# EAGLE design railsegments (EAGLE 4.16)
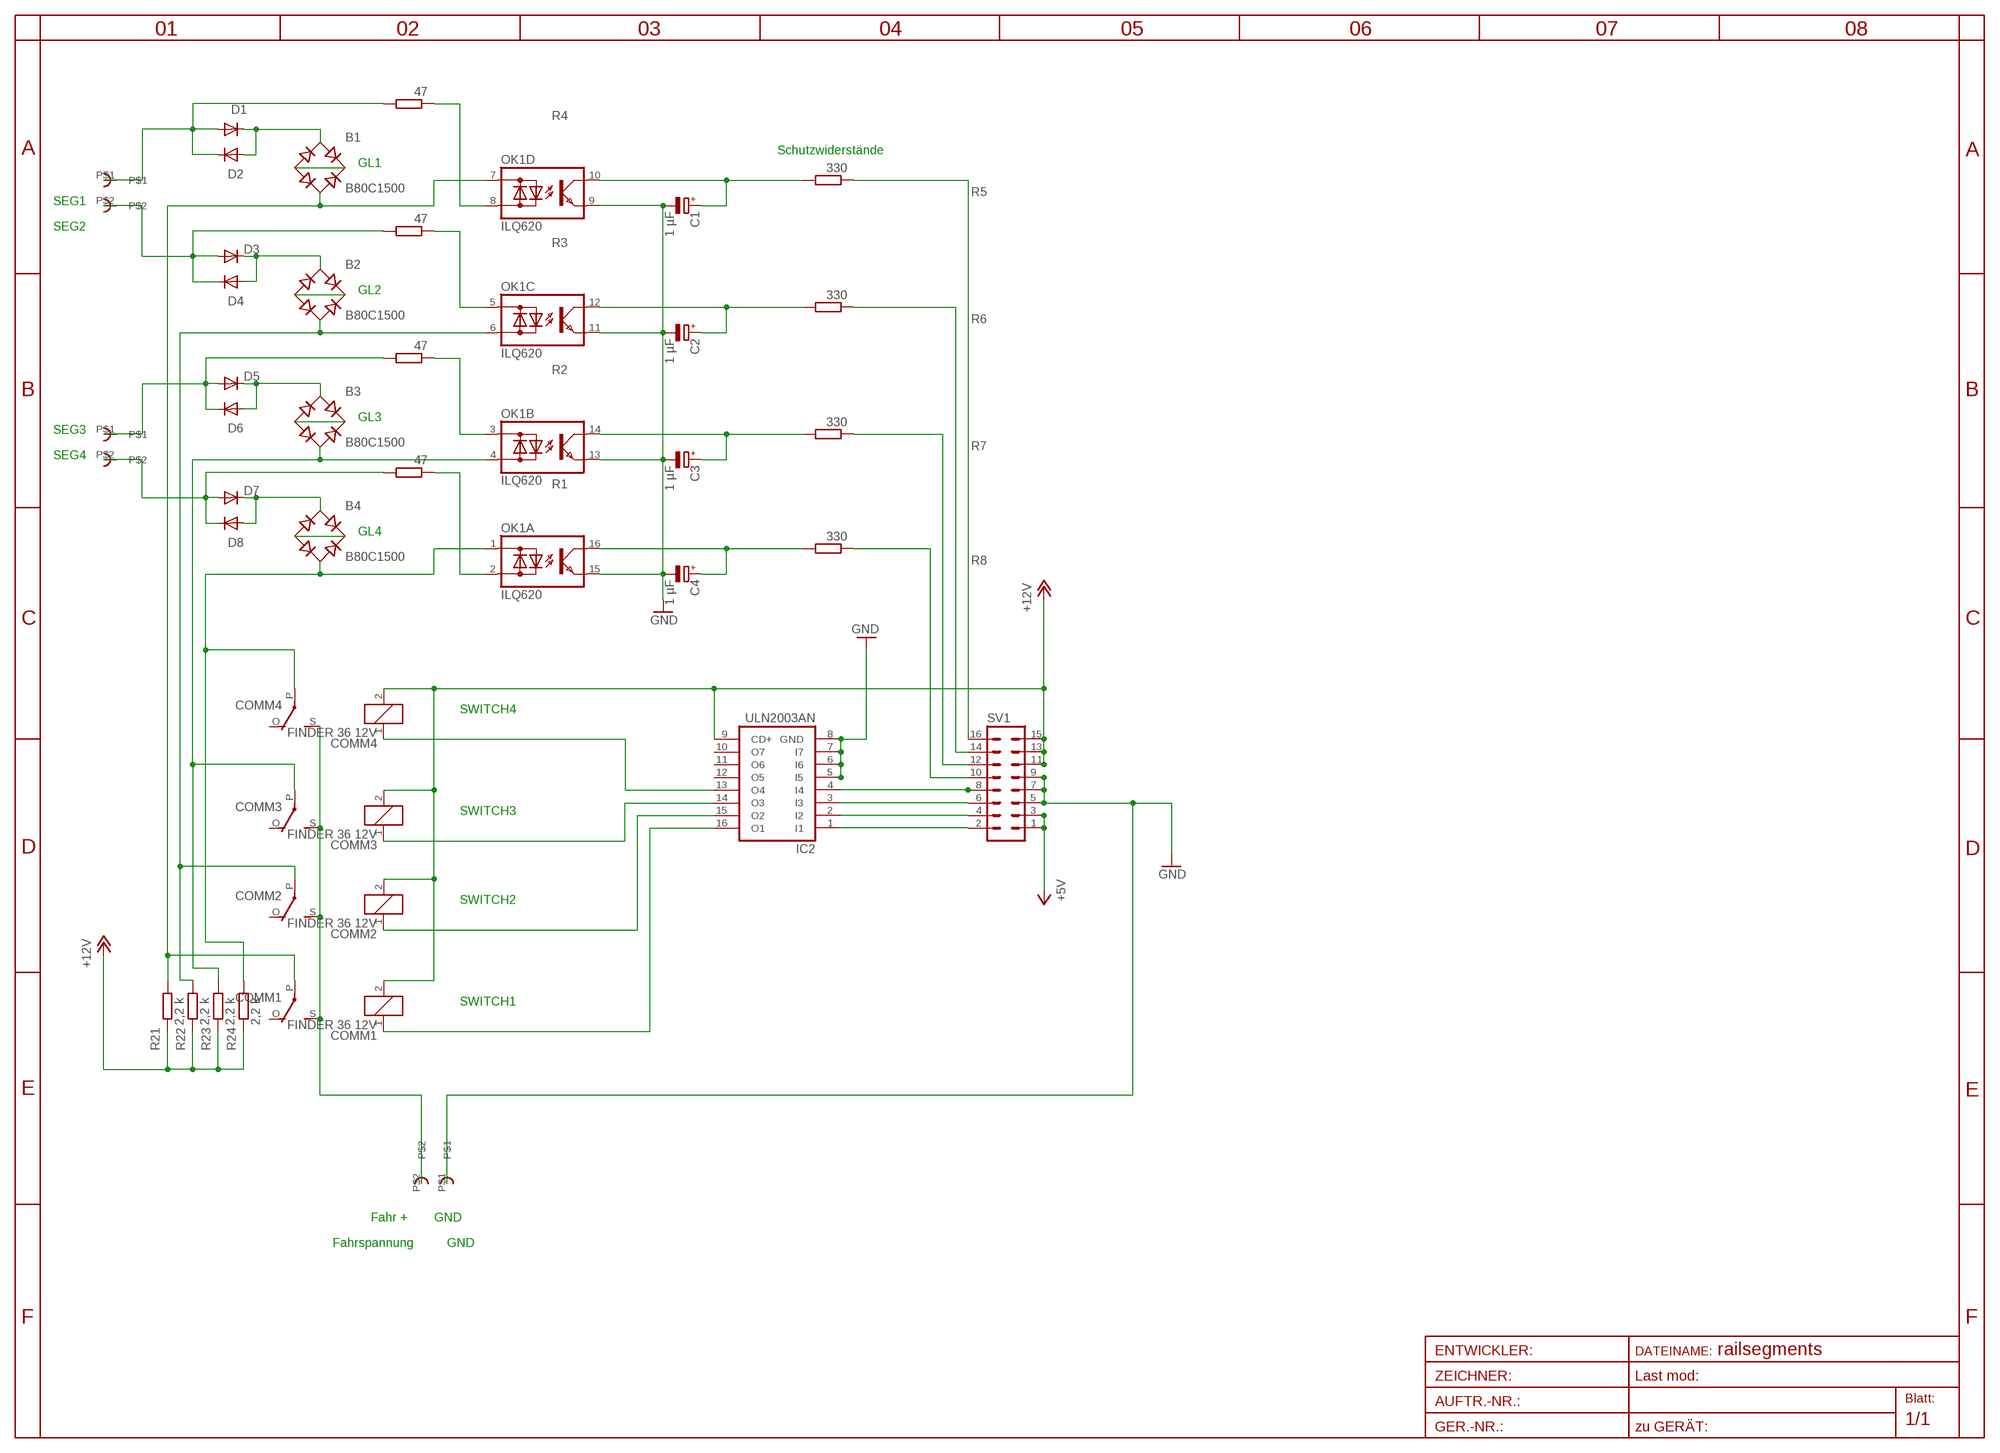
[diagram p0: schematic, sheet 1]

## Parts
B1  B80C1500  RECTIFIER-RB1A  [RB1A]
B2  B80C1500  RECTIFIER-RB1A  [RB1A]
B3  B80C1500  RECTIFIER-RB1A  [RB1A]
B4  B80C1500  RECTIFIER-RB1A  [RB1A]
C1  1 µF  CPOL-EUE2-4  [E2-4]
C2  1 µF  CPOL-EUE2-4  [E2-4]
C3  1 µF  CPOL-EUE2-4  [E2-4]
C4  1 µF  CPOL-EUE2-4  [E2-4]
COMM1  FINDER 36 12V  G5L  [G5LE]
COMM2  FINDER 36 12V  G5L  [G5LE]
COMM3  FINDER 36 12V  G5L  [G5LE]
COMM4  FINDER 36 12V  G5L  [G5LE]
D1  DIODE-D-2.5  [D-2.5]
D2  DIODE-D-2.5  [D-2.5]
D3  DIODE-D-2.5  [D-2.5]
D4  DIODE-D-2.5  [D-2.5]
D5  DIODE-D-2.5  [D-2.5]
D6  DIODE-D-2.5  [D-2.5]
D7  DIODE-D-2.5  [D-2.5]
D8  DIODE-D-2.5  [D-2.5]
GND  RIACON101-2  [RIACON101-2]
IC2  ULN2003AN  [DIL16]
OK1  ILQ620  [DIL16]
PRUEFSPANNUNG3  RIACON101-2  [RIACON101-2]
PRUEFSPANNUNG4  RIACON101-2  [RIACON101-2]
R1  47  R-EU_0204/5  [0204/5]
R2  47  R-EU_0204/5  [0204/5]
R3  47  R-EU_0204/5  [0204/5]
R4  47  R-EU_0204/5  [0204/5]
R5  330  R-EU_0204/2V  [0204V]
R6  330  R-EU_0204/2V  [0204V]
R7  330  R-EU_0204/2V  [0204V]
R8  330  R-EU_0204/2V  [0204V]
R21  2,2 k  R-EU_0204/2V  [0204V]
R22  2,2 k  R-EU_0204/2V  [0204V]
R23  2,2 k  R-EU_0204/2V  [0204V]
R24  2,2 k  R-EU_0204/2V  [0204V]
SV1  ML16  [ML16]

## Nets
+5V: SV1.1 SV1.3
+12V: COMM1.2 COMM2.2 COMM3.2 COMM4.2 IC2.9(CD+) R21.1 R22.1 R23.1 R24.1 SV1.11 SV1.13 SV1.15
GND: C1.- C2.- C3.- C4.- GND.P$1 IC2.5(I5) IC2.6(I6) IC2.7(I7) IC2.8(GND) OK1.9(D:E) OK1.11(C:E) OK1.13(B:E) OK1.15(A:E) SV1.5 SV1.7 SV1.9
IN_1: IC2.1(I1) SV1.2
IN_2: IC2.2(I2) SV1.4
IN_3: IC2.3(I3) SV1.6
IN_4: IC2.4(I4) SV1.8
N$1: OK1.2(A:AC2) R1.1
N$2: OK1.8(D:AC2) R4.1
N$3: B1.AC2 COMM1.P(2:P) OK1.7(D:AC1) R21.2
N$10: B1.+ B1.-
N$11: B2.+ B2.-
N$12: B3.+ B3.-
N$13: B4.+ B4.-
N$17: B1.AC1 D1.C D2.A
N$18: B4.AC1 D7.C D8.A
OPTO_OUT_1: C1.+ OK1.10(D:C) R5.2
OPTO_OUT_2: C2.+ OK1.12(C:C) R6.2
OPTO_OUT_3: C3.+ OK1.14(B:C) R7.2
OPTO_OUT_4: C4.+ OK1.16(A:C) R8.2
OUT_1: R5.1 SV1.16
OUT_2: R6.1 SV1.14
OUT_3: R7.1 SV1.12
OUT_4: R8.1 SV1.10
RAILPOWER_PLUS: COMM1.S(2:S) COMM2.S(2:S) COMM3.S(2:S) COMM4.S(2:S) GND.P$2
RELAY_DRIVE_1: COMM1.1 IC2.16(O1)
RELAY_DRIVE_2: COMM2.1 IC2.15(O2)
RELAY_DRIVE_3: COMM3.1 IC2.14(O3)
RELAY_DRIVE_4: COMM4.1 IC2.13(O4)
SEG1: D1.A D2.C PRUEFSPANNUNG4.P$1 R4.2
SEG2: B2.AC1 D3.C D4.A
SEG3: B3.AC1 D5.C D6.A
SEG5: D3.A D4.C PRUEFSPANNUNG4.P$2 R3.2
SEG6: D5.A D6.C PRUEFSPANNUNG3.P$1 R2.2
SEG7: D7.A D8.C PRUEFSPANNUNG3.P$2 R1.2
SEG_SW2: B2.AC2 COMM2.P(2:P) OK1.6(C:AC2) R22.2
SEG_SW2A: OK1.5(C:AC1) R3.1
SEG_SW3: B3.AC2 COMM3.P(2:P) OK1.4(B:AC2) R23.2
SEG_SW3A: OK1.3(B:AC1) R2.1
SEG_SW4: B4.AC2 COMM4.P(2:P) OK1.1(A:AC1) R24.2
Unconnected: COMM1.O(2:O) COMM2.O(2:O) COMM3.O(2:O) COMM4.O(2:O) IC2.10(O7) IC2.11(O6) IC2.12(O5)

## Notes on the sheet
- Schutzwiderstände
- GL1
- SEG1
- SEG2
- GL2
- GL3
- SEG3
- SEG4
- GL4
- SWITCH4
- SWITCH3
- SWITCH2
- SWITCH1
- Fahr + | GND
- Fahrspannung | GND

## Library data of the parts
B1-B4 = rectifier:RECTIFIER-: Rectifier
C1-C4 = rcl:CPOL-EU: POLARIZED CAPACITOR, European symbol
COMM1-COMM4 = relay:G5L: RELAY 1 x switch, 10 A/120 V AC, 8 A/30 V ADC, Omron
D1-D8 = diode:DIODE-: DIODE
GND PRUEFSPANNUNG3 PRUEFSPANNUNG4 = con-riacon101:RIACON101-2: Riaconn Schreaubklemme 101
IC2 = uln-udn:ULN2003A: DRIVER ARRAY
OK1 = optocoupler:ILQ620: SIEMENS OPTO COUPLER
R1-R8 R21-R24 = rcl:R-EU_: RESISTOR, European symbol
SV1 = con-harting-ml:ML16: HARTING

## Board
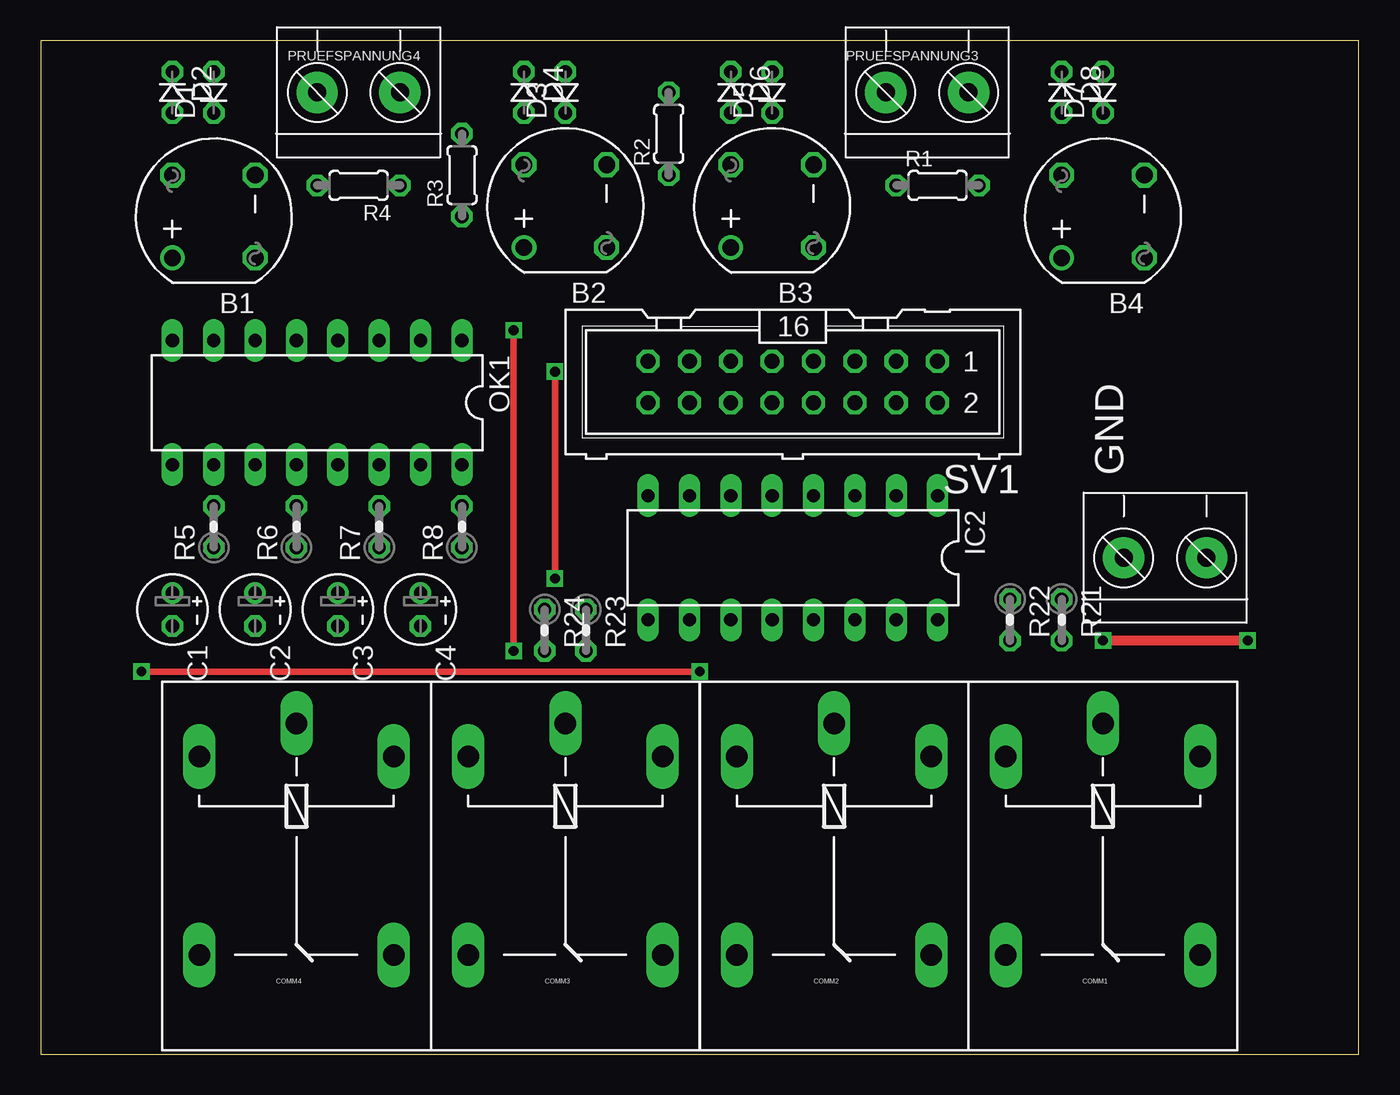
[diagram p1: board, top side]
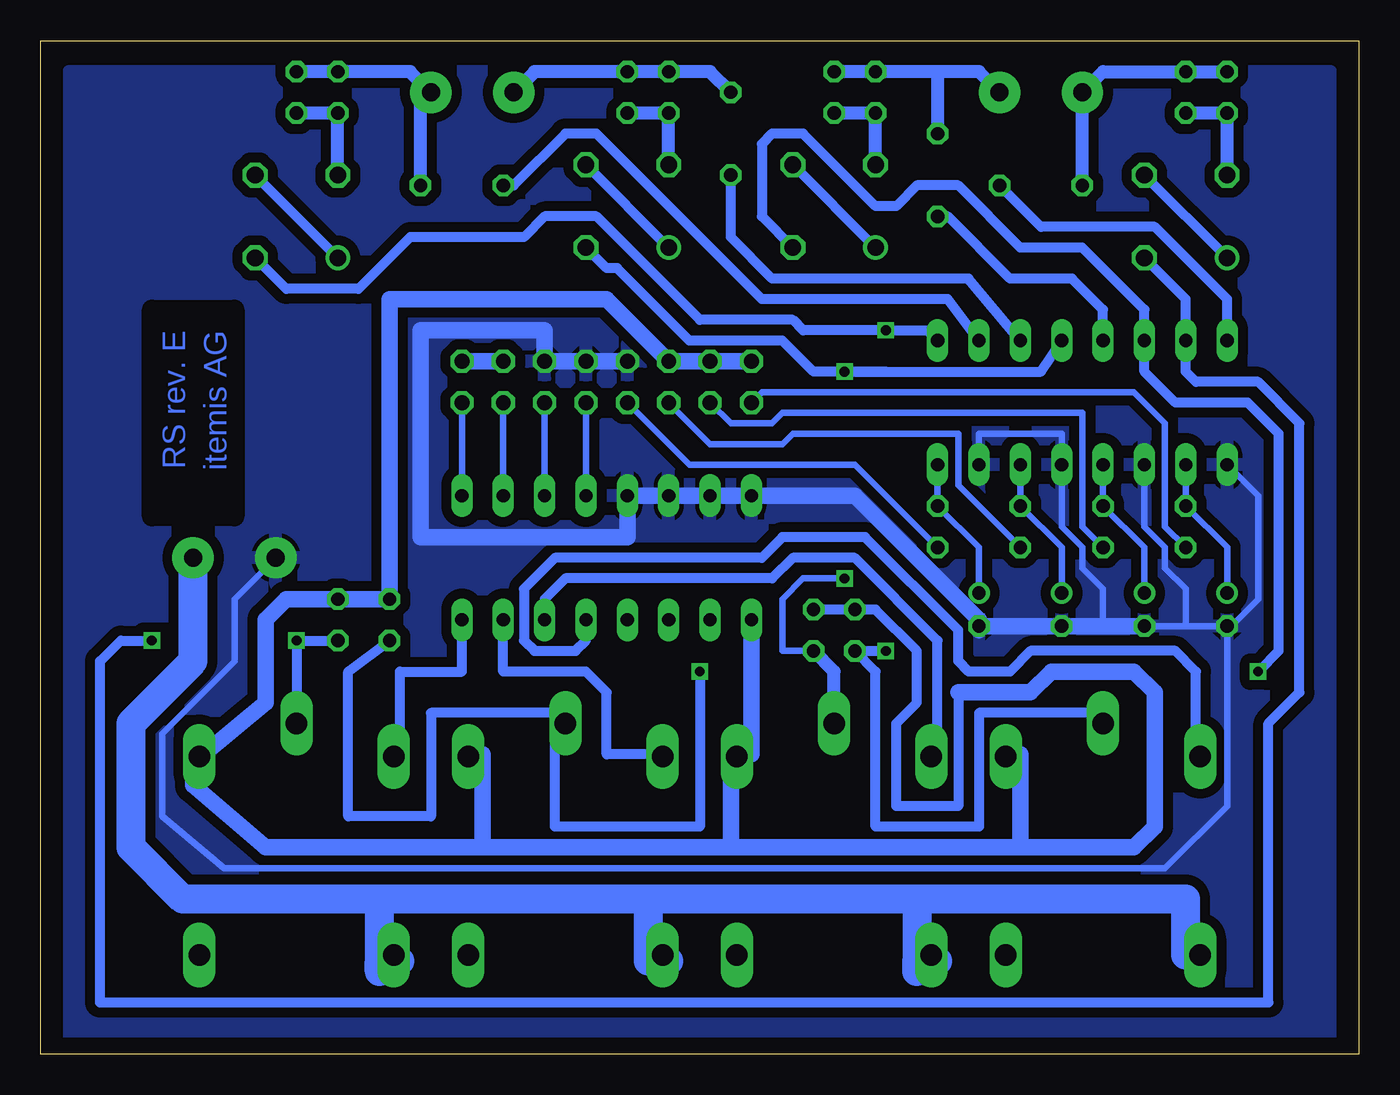
[diagram p2: board, bottom side, seen from below]

Size 80.95 x 62.22 mm. Coordinates in mm from the lower left corner, seen from the top.
Outline: 0,0 80.95,0 80.95,62.22 0,62.22 0,0
Copper layers (1*16): Top 0.035mm / dielectric 1.5mm / Bottom 0.035mm
Design rules "default": minimum track width 10mil, minimum drill 24mil, track to track 8mil, track to pad 8mil, pad to pad 8mil, via to via 8mil, smd to smd 8mil, copper to edge 40mil, drill to drill 8mil, minimum pad ring 10mil, minimum via ring 8mil, stop-mask expansion 4mil, vias tented up to drill 0mil, thermal gap 10mil
tRestrict: area 1.1,1.3 to 6.2,55.9; area 75.4,0.6 to 80.5,55.2
bRestrict: area 69.1,33 to 74.1,45.7

### Footprints (pad centres in the part's own frame; a part is rotated, then mirrored left to right if it is on the bottom)
RB1A = drill 1.016 round: + -2.54,2.54 | drill 1.016 octagon: - 2.54,-2.54; AC1 2.54,2.54; AC2 -2.54,-2.54
E2-4 = drill 0.813 pad 1.27 round: + -1.016,0 | drill 0.813 pad 1.27 octagon: - 1.016,0
G5LE = drill 1.321 long: 1 -7.493,-5.969; 2 -7.493,5.969; O 4.699,5.969; P -9.525,0; S 4.699,-5.969
D-2.5 = drill 0.813 octagon: A 1.27,0; C -1.27,0
RIACON101-2 = drill 1.1 pad 2.54 round: P$1 0,2.54; P$2 0,-2.54
DIL16 = drill 0.813 long: 1 -8.89,-3.81; 2 -6.35,-3.81; 3 -3.81,-3.81; 4 -1.27,-3.81; 5 1.27,-3.81; 6 3.81,-3.81; 7 6.35,-3.81; 8 8.89,-3.81; 9 8.89,3.81; 10 6.35,3.81; 11 3.81,3.81; 12 1.27,3.81; 13 -1.27,3.81; 14 -3.81,3.81; 15 -6.35,3.81; 16 -8.89,3.81
0204/5 = drill 0.813 octagon: 1 -2.54,0; 2 2.54,0
0204V = drill 0.813 octagon: 1 -1.27,0; 2 1.27,0
ML16 = drill 0.914 octagon: 1 -8.89,-1.27; 2 -8.89,1.27; 3 -6.35,-1.27; 4 -6.35,1.27; 5 -3.81,-1.27; 6 -3.81,1.27; 7 -1.27,-1.27; 8 -1.27,1.27; 9 1.27,-1.27; 10 1.27,1.27; 11 3.81,-1.27; 12 3.81,1.27; 13 6.35,-1.27; 14 6.35,1.27; 15 8.89,-1.27; 16 8.89,1.27

### Placement (x,y rotation side)
B1  10.63,51.43 90 top
B2  32.22,52.07 90 top
B3  44.92,52.07 90 top
B4  65.24,51.43 90 top
C1  8.09,27.3 270 top
C2  13.17,27.3 270 top
C3  18.25,27.3 270 top
C4  23.33,27.3 270 top
COMM1  65.24,10.79 270 top
COMM2  48.73,10.79 270 top
COMM3  32.22,10.79 270 top
COMM4  15.71,10.79 270 top
D1  10.63,59.05 90 top
D2  8.09,59.05 270 top
D3  32.22,59.05 90 top
D4  29.68,59.05 270 top
D5  44.92,59.05 90 top
D6  42.38,59.05 270 top
D7  65.24,59.05 90 top
D8  62.7,59.05 270 top
GND  69.05,30.47 90 top
IC2  46.19,30.47 180 top
OK1  16.98,40 180 top
PRUEFSPANNUNG3  54.45,59.05 90 top
PRUEFSPANNUNG4  19.52,59.05 90 top
R1  55.08,53.34 0 top
R2  38.57,56.51 90 top
R3  25.87,53.97 90 top
R4  19.52,53.34 180 top
R5  10.63,32.38 90 top
R6  15.71,32.38 90 top
R7  20.79,32.38 90 top
R8  25.87,32.38 90 top
R21  62.7,26.66 270 top
R22  59.52,26.66 270 top
R23  33.49,26.03 270 top
R24  30.95,26.03 270 top
SV1  46.19,41.27 180 top

### Tracks (layer width: path | path; a pad name or v marks a point on that pad's centre or on a via)
+5V
  Bottom 1.016: SV1.3 SV1.1
+12V
  Bottom 0.406: SV1.15 SV1.13 SV1.11 | 71.59,18.41 COMM1.2 70.95,18.41 | 38.57,18.41 38.57,18.28 COMM3.2 | R24.1 R23.1
  Bottom 0.61: 24.6,22.22 24.6,15.24 28.41,15.24 28.41,20.31 27.14,21.58 27.14,24.76 29.68,27.3 R24.1 R23.1
  Bottom 1.016: COMM4.2 20.79,18.41 20.79,12.7 | 20.79,12.7 38.57,12.7 | 38.57,12.7 38.57,18.41 37.3,18.41 IC2.9 | 38.57,12.7 53.81,12.7 | 53.81,12.7 67.14,12.7 71.59,16.5 71.59,18.41 | COMM2.2 53.81,18.41 53.81,12.7 | SV1.15 SV1.11 46.19,46.35 59.52,46.35 R22.1 R21.1 65.88,27.93 67.14,26.66 67.14,21.58 70.95,18.41 | 20.79,12.7 13.81,12.7 12.54,13.97 12.54,22.22 13.81,23.49 18.88,23.49 20.15,22.22 24.6,22.22
GND
  Bottom 0.406: C2.- 13.17,26.03 12.92,26.28 10.63,26.28 | 10.63,26.28 C1.- 8.09,26.03 | C3.- 18.25,26.03 18,26.28 | 23.33,26.03 C4.- 23.33,26.66 | OK1.15 23.33,38.1 18.25,38.1 OK1.13 18.25,32.38 16.98,31.11 16.98,29.84 15.71,28.57 15.71,26.28 | OK1.9 6.18,34.29 6.18,27.93 8.09,26.03 | OK1.11 13.17,32.38 11.9,31.11 11.9,29.84 10.63,28.57 10.63,26.28 | GND.P$1 67.14,30.47 67.14,29.84 69.05,27.93 69.05,24.12 73.5,19.68 73.5,14.6 69.69,11.43 11.9,11.43 8.09,15.24 8.09,26.03
  Bottom 1.016: C2.- 15.71,26.28 18,26.28 | C3.- 23.08,26.28 23.33,26.03 | SV1.9 SV1.7 SV1.5 50,44.45 57.62,44.45 57.62,31.74 44.92,31.74 IC2.5 IC2.6 IC2.7 IC2.8 30.95,34.29 23.33,26.66
  pour Bottom (isolate 0.61): 1.74,60.32 79.21,60.32 79.21,0.63 1.74,0.63
IN_1
  Bottom 0.406: IC2.1 SV1.2
IN_2
  Bottom 0.406: IC2.2 SV1.4
IN_3
  Bottom 0.406: IC2.3 SV1.6
IN_4
  Bottom 0.406: IC2.4 SV1.8
N$1
  Bottom 0.61: R1.1 51.91,53.34 48.73,56.51 46.82,56.51 36.66,46.35 25.23,46.35 OK1.2
N$2
  Bottom 0.61: R4.1 19.52,50.8 12.54,50.8 8.09,46.35 OK1.8
N$3  (via drill 0.6)
  Top 0.61: v74.13,25.39 v65.24,25.39
  Bottom 0.406: COMM1.P 65.24,19.68
  Bottom 0.61: B1.AC2 10.63,46.35 OK1.7 10.63,41.91 10,41.27 6.18,41.27 3.64,38.73 3.64,22.22 5.55,20.31 5.55,3.17 77.3,3.17 77.3,24.12 76.03,25.39 v74.13,25.39 | COMM1.P v65.24,25.39 R21.2
N$10
  Bottom 0.61: B1.+ B1.-
N$11
  Bottom 0.61: B2.+ B2.-
N$12
  Bottom 0.61: B3.+ B3.-
N$13
  Bottom 0.61: B4.+ B4.-
N$17
  Bottom 0.813: D2.A D1.C D2.A | B1.AC1 D2.A
N$18
  Bottom 0.813: D7.C D8.A B4.AC1
OPTO_OUT_1
  Bottom 0.406: OK1.10 R5.2 8.09,31.11 C1.+
OPTO_OUT_2
  Bottom 0.406: OK1.12 R6.2 13.17,31.11 C2.+
OPTO_OUT_3
  Bottom 0.406: OK1.14 R7.2 18.25,31.11 C3.+
OPTO_OUT_4
  Bottom 0.406: OK1.16 R8.2 23.33,31.11 C4.+
OUT_1
  Bottom 0.406: R5.1 11.9,32.38 11.9,38.73 13.81,40.64 36.66,40.64 SV1.16
OUT_2
  Bottom 0.406: R6.1 16.98,32.38 16.98,39.37 26.5,39.37 35.39,39.37 36.03,38.73 38.57,38.73 SV1.14
OUT_3
  Bottom 0.406: R7.1 24.6,34.92 24.6,38.1 28.41,38.1 34.76,38.1 35.39,37.46 39.84,37.46 SV1.12
OUT_4
  Bottom 0.406: R8.1 30.95,36.19 41.11,36.19 SV1.10
RAILPOWER_PLUS
  Bottom 0.406: COMM3.S 27.14,6.09 27.14,5.08 | 42.38,6.09 42.38,6.34 | 42.38,6.09 COMM2.S | 42.38,5.71 42.38,6.09 | COMM1.S 60.16,6.09 60.16,5.08
  Bottom 1.778: COMM4.S 10.63,6.09 10.63,9.52 27.14,9.52 | 25.87,5.71 27.14,5.71 27.14,5.08 27.14,9.52 | 27.14,9.52 43.65,9.52 | 42.38,5.71 43.65,5.71 43.65,9.52 | 43.65,9.52 60.16,9.52 | 58.89,5.71 60.16,5.71 60.16,5.08 60.16,9.52 | 60.16,9.52 72.22,9.52 75.4,12.7 75.4,20.31 71.59,24.12 GND.P$2
RELAY_DRIVE_1
  Bottom 0.61: IC2.16 55.08,23.49 58.89,23.49 58.89,18.41 COMM1.1
RELAY_DRIVE_2
  Bottom 0.406: COMM2.1 42.38,18.41
  Bottom 0.61: IC2.15 52.54,23.49 47.46,23.49 46.19,22.22 46.19,18.41 42.38,18.41
RELAY_DRIVE_3
  Bottom 0.61: IC2.14 50,27.93 48.73,29.2 36.03,29.2 34.76,30.47 30.95,30.47 25.87,25.39 25.87,18.41 COMM3.1
RELAY_DRIVE_4
  Bottom 0.61: COMM4.1 10,18.41 10,23.49 11.27,24.76 20.15,24.76 21.42,23.49 23.96,23.49 24.6,24.12 24.6,26.03 30.31,31.74 35.39,31.74 36.66,30.47 49.37,30.47 51.27,28.57 51.27,25.39 50.63,24.76 48.09,24.76 47.46,25.39 IC2.13
SEG1
  Bottom 0.813: D2.C D1.A 15.71,60.32 PRUEFSPANNUNG4.P$1 R4.2
SEG2
  Bottom 0.813: D3.C D4.A B2.AC1
SEG3
  Bottom 0.813: D5.C D6.A B3.AC1
SEG5
  Bottom 0.813: D3.A D4.C 27.77,60.32 25.87,60.32 | 25.87,60.32 23.33,60.32 PRUEFSPANNUNG4.P$2 | 25.87,60.32 R3.2
SEG6
  Bottom 0.813: PRUEFSPANNUNG3.P$1 50.63,60.32 D5.A D6.C 39.84,60.32 R2.2
SEG7
  Bottom 0.813: D7.A D8.C 58.25,60.32 PRUEFSPANNUNG3.P$2 57.62,58.41 R1.2
SEG_SW2  (via drill 0.6)
  Top 0.406: v6.18,23.49 v40.48,23.49
  Bottom 0.406: 48.73,19.68 COMM2.P 49.37,20.95
  Bottom 0.61: R22.2 62.06,23.49 62.06,14.6 56.98,14.6 56.98,20.95 49.37,20.95 49.37,13.97 40.48,13.97 v40.48,23.49 | v6.18,23.49 4.92,24.76 4.92,38.1 6.82,40 11.27,40 13.17,41.91 OK1.6 13.17,45.72 16.98,49.53 20.79,49.53 24.6,53.34 27.14,53.34 28.41,52.07 29.68,52.07 34.12,56.51 36.03,56.51 36.66,55.88 36.66,51.43 B2.AC2
SEG_SW2A
  Bottom 0.61: R3.1 25.23,51.43 21.42,47.62 17.61,47.62 15.71,45.72 OK1.5
SEG_SW3  (via drill 0.6)
  Top 0.406: v31.58,29.2 v31.58,41.91
  Bottom 0.406: R23.2 35.39,24.76 35.39,27.93 34.12,29.2 v31.58,29.2
  Bottom 0.61: B3.AC2 46.19,48.26 45.55,48.26 41.11,43.81 35.39,43.81 33.49,41.91 29.04,41.91 | 29.04,41.91 19.52,41.91 OK1.4 | v31.58,41.91 29.04,41.91
  Bottom 0.813: COMM3.P 32.22,23.49 R23.2
SEG_SW3A
  Bottom 0.61: R2.1 38.57,50.16 36.03,47.62 23.96,47.62 OK1.3
SEG_SW4  (via drill 0.6)
  Top 0.406: v29.04,24.76 v29.04,44.45
  Bottom 0.61: 15.71,19.68 COMM4.P 15.71,20.95 23.33,20.95 23.33,13.97 29.68,13.97 29.68,23.49 R24.2 v29.04,24.76 | B4.AC2 65.88,46.98 61.43,46.98 58.25,50.16 51.27,50.16 50,51.43 46.82,51.43 40.48,45.08 34.76,45.08 34.12,44.45 v29.04,44.45 26.5,44.45 OK1.1

### Text on the board
Bottom: itemis AG | RS rev. E